# Altium project SixAx.PrjPcb
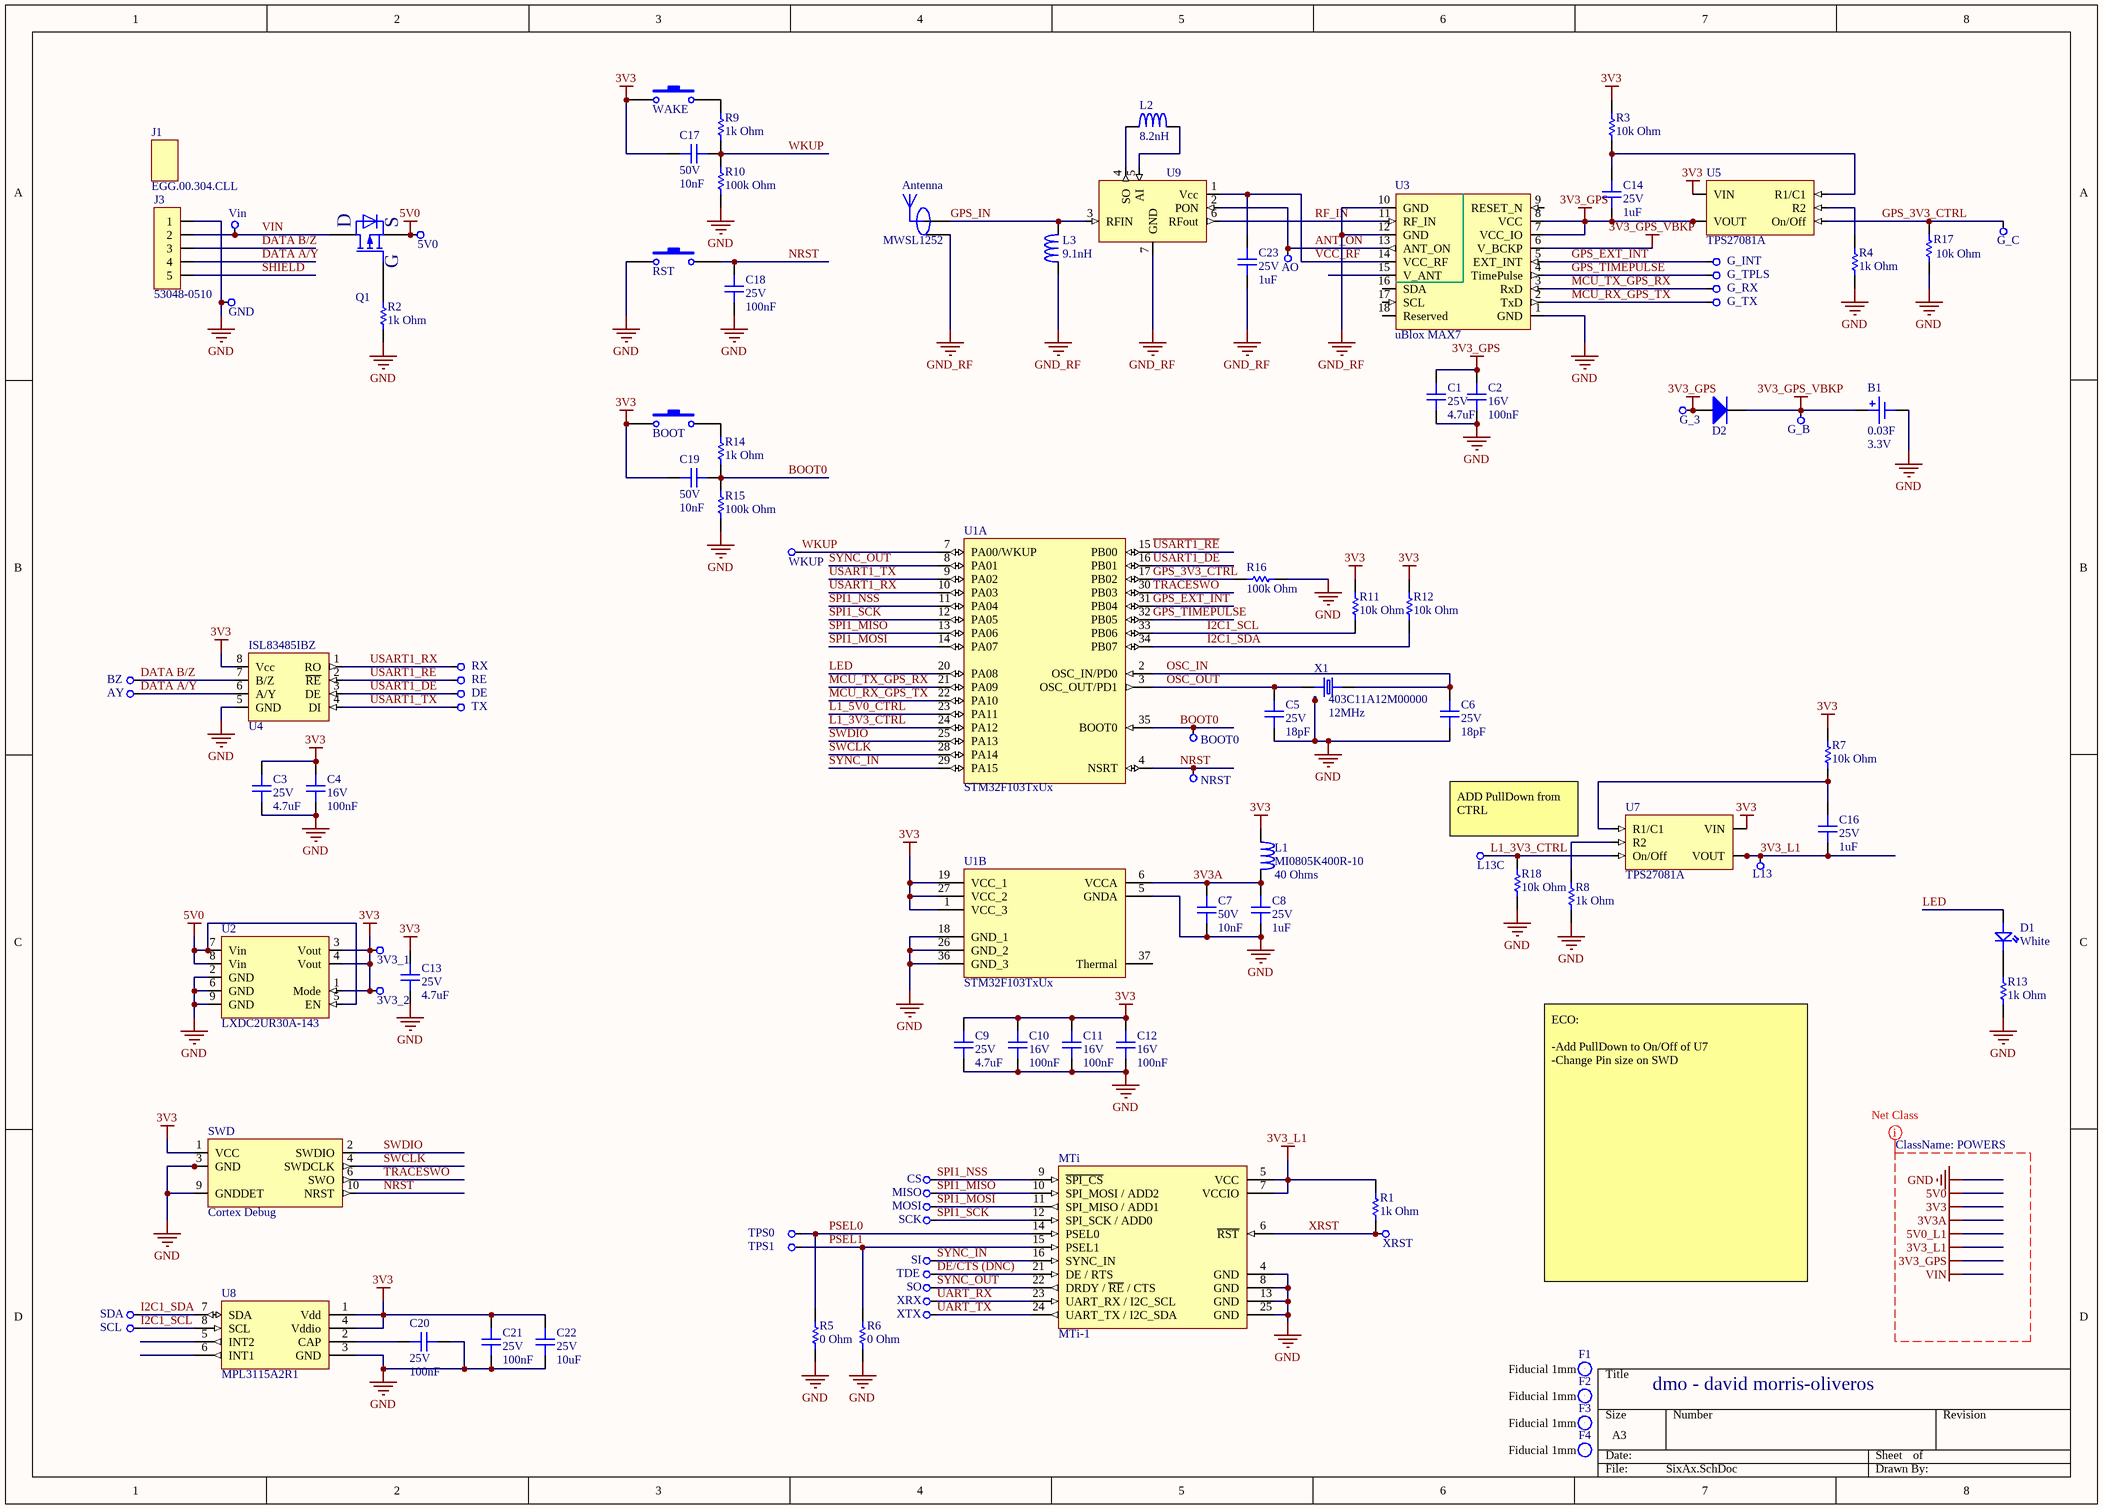
[diagram p0: SixAx.SchDoc]
1 sheet, 106 parts. Net scope: global (net labels, ports and power ports of the same name join across sheets).
Board file: SixAx.PcbDoc

## Sheet SixAx.SchDoc
size A3

### Parts
3V3_1  TEST  [TEST_1.0mm, SMD]  (value not drawn)
3V3_2  TEST  [TEST_1.0mm, SMD]  (value not drawn)
5V0  TEST  [TEST_1.0mm, SMD]  (value not drawn)
Antenna  MWSL1252  [MWSL1252 - Vertical - SMALLER]
AO  TEST  [TEST_0.5mm, SMD]  (value not drawn)
AY  TEST  [TEST_0.5mm, SMD]  (value not drawn)
B1  value 0.03F  Voltage: 3.3V  [PAS409HR-VE5R]  (hidden comment: PAS409HR-VE5R)
BOOT  TL1015AF160QG  [TL1015AF160QG]  (value not drawn)
BOOT0  TEST  [TEST_0.5mm, SMD]  (value not drawn)
BZ  TEST  [TEST_0.5mm, SMD]  (value not drawn)
C1  value 4.7uF  Voltage Rating: 25V  [CAP 0805]  (hidden comment: CL21A475KAQNNNE)
C2  value 100nF  Voltage Rating: 16V  [CAP 0402]  (hidden comment: CL05B104KO5NNNC)
C3  value 4.7uF  Voltage Rating: 25V  [CAP 0805]  (hidden comment: CL21A475KAQNNNE)
C4  value 100nF  Voltage Rating: 16V  [CAP 0402]  (hidden comment: CL05B104KO5NNNC)
C5  value 18pF  Voltage Rating: 25V  [CAP 0402]  (hidden comment: GRM1555C1E180JA01D)
C6  value 18pF  Voltage Rating: 25V  [CAP 0402]  (hidden comment: GRM1555C1E180JA01D)
C7  value 10nF  Voltage Rating: 50V  [CAP 0402]  (hidden comment: CL05B103KB5NNNC)
C8  value 1uF  Voltage Rating: 25V  [CAP 0603]  (hidden comment: TMK107B7105KA-T)
C9  value 4.7uF  Voltage Rating: 25V  [CAP 0805]  (hidden comment: CL21A475KAQNNNE)
C10  value 100nF  Voltage Rating: 16V  [CAP 0402]  (hidden comment: CL05B104KO5NNNC)
C11  value 100nF  Voltage Rating: 16V  [CAP 0402]  (hidden comment: CL05B104KO5NNNC)
C12  value 100nF  Voltage Rating: 16V  [CAP 0402]  (hidden comment: CL05B104KO5NNNC)
C13  value 4.7uF  Voltage Rating: 25V  [CAP 0805]  (hidden comment: CL21A475KAQNNNE)
C14  value 1uF  Voltage Rating: 25V  [CAP 0603]  (hidden comment: CL10A105KA8NNNC)
C16  value 1uF  Voltage Rating: 25V  [CAP 0603]  (hidden comment: CL10A105KA8NNNC)
C17  value 10nF  Voltage Rating: 50V  [CAP 0402]  (hidden comment: CL05B103KB5NNNC)
C18  value 100nF  Voltage Rating: 25V  [CAP 0402]  (hidden comment: CL05A104KA5NNNC)
C19  value 10nF  Voltage Rating: 50V  [CAP 0402]  (hidden comment: CL05B103KB5NNNC)
C20  value 100nF  Voltage Rating: 25V  [CAP 0402]  (hidden comment: CL05A104KA5NNNC)
C21  value 100nF  Voltage Rating: 25V  [CAP 0402]  (hidden comment: CL05A104KA5NNNC)
C22  value 10uF  Voltage Rating: 25V  [CAP 0805]  (hidden comment: CL21A106KAYNNNE)
C23  value 1uF  Voltage Rating: 25V  [CAP 0603]  (hidden comment: CL10A105KA8NNNC)
CS  TEST  [TEST_0.5mm, SMD]  (value not drawn)
D1  White  [LED 0603]
D2  CDSQR400B  [SOD-923F]  (value not drawn)
DE  TEST  [TEST_0.5mm, SMD]  (value not drawn)
F1  (no value)  [Fiducial_1mm]
F2  (no value)  [Fiducial_1mm]
F3  (no value)  [Fiducial_1mm]
F4  (no value)  [Fiducial_1mm]
G_3  TEST  [TEST_0.5mm, SMD]  (value not drawn)
G_B  TEST  [TEST_0.5mm, SMD]  (value not drawn)
G_C  TEST  [TEST_0.5mm, SMD]  (value not drawn)
G_INT  TEST  [TEST_0.5mm, SMD]  (value not drawn)
G_RX  TEST  [TEST_0.5mm, SMD]  (value not drawn)
G_TPLS  TEST  [TEST_0.5mm, SMD]  (value not drawn)
G_TX  TEST  [TEST_0.5mm, SMD]  (value not drawn)
GND  TEST  [TEST_1.0mm, SMD]  (value not drawn)
J1  EGG.00.304.CLL  [EGG.00.304.CLL]
J3  53048-0510  [PicoBlade, 53048-0510]
L1  MI0805K400R-10  Impedence: 40 Ohms  [IND 0805]
L2  value 8.2nH  [IND 0402]  (hidden comment: LQW15AN8N2J00D)
L3  value 9.1nH  [IND 0402]  (hidden comment: LQW15AN9N1J00D)
L13  TEST  [TEST_0.5mm, SMD]  (value not drawn)
L13C  TEST  [TEST_0.5mm, SMD]  (value not drawn)
MISO  TEST  [TEST_0.5mm, SMD]  (value not drawn)
MOSI  TEST  [TEST_0.5mm, SMD]  (value not drawn)
MTi  MTi-1  [PLCC28 - XSens MTi-1 Special]
NRST  TEST  [TEST_0.5mm, SMD]  (value not drawn)
Q1  PMV48XP,215  [SOT23-3]  (value not drawn)
R1  value 1k Ohm  [RES 0402]  (hidden comment: P311-1.00KLRTR-ND)
R2  value 1k Ohm  [RES 0402]  (hidden comment: P311-1.00KLRTR-ND)
R3  value 10k Ohm  [RES 0402]  (hidden comment: P311-10.0KLRTR-ND)
R4  value 1k Ohm  [RES 0402]  (hidden comment: P311-1.00KLRTR-ND)
R5  value 0 Ohm  [RES 0402]  (hidden comment: P311-0.0JRTR-ND)
R6  value 0 Ohm  [RES 0402]  (hidden comment: P311-0.0JRTR-ND)
R7  value 10k Ohm  [RES 0402]  (hidden comment: P311-10.0KLRTR-ND)
R8  value 1k Ohm  [RES 0402]  (hidden comment: P311-1.00KLRTR-ND)
R9  value 1k Ohm  [RES 0402]  (hidden comment: P311-1.00KLRTR-ND)
R10  value 100k Ohm  [RES 0402]  (hidden comment: P311-100KLRTR-ND)
R11  value 10k Ohm  [RES 0402]  (hidden comment: P311-10.0KLRTR-ND)
R12  value 10k Ohm  [RES 0402]  (hidden comment: P311-10.0KLRTR-ND)
R13  value 1k Ohm  [RES 0402]  (hidden comment: P311-1.00KLRTR-ND)
R14  value 1k Ohm  [RES 0402]  (hidden comment: P311-1.00KLRTR-ND)
R15  value 100k Ohm  [RES 0402]  (hidden comment: P311-100KLRTR-ND)
R16  value 100k Ohm  [RES 0402]  (hidden comment: P311-100KLRTR-ND)
R17  value 10k Ohm  [RES 0402]  (hidden comment: P311-10.0KLRTR-ND)
R18  value 10k Ohm  [RES 0402]  (hidden comment: P311-10.0KLRTR-ND)
RE  TEST  [TEST_0.5mm, SMD]  (value not drawn)
RST  TL1015AF160QG  [TL1015AF160QG]  (value not drawn)
RX  TEST  [TEST_0.5mm, SMD]  (value not drawn)
SCK  TEST  [TEST_0.5mm, SMD]  (value not drawn)
SCL  TEST  [TEST_0.5mm, SMD]  (value not drawn)
SDA  TEST  [TEST_0.5mm, SMD]  (value not drawn)
SI  TEST  [TEST_0.5mm, SMD]  (value not drawn)
SO  TEST  [TEST_0.5mm, SMD]  (value not drawn)
SWD  CORTEX_DEBUG  [H_05x02 - 1.27mm]  (value not drawn)
TDE  TEST  [TEST_0.5mm, SMD]  (value not drawn)
TPS0  TEST  [TEST_0.5mm, SMD]  (value not drawn)
TPS1  TEST  [TEST_0.5mm, SMD]  (value not drawn)
TX  TEST  [TEST_0.5mm, SMD]  (value not drawn)
U1  STM32F103TxUx  [QFN36 - 0.5mm - NO THERMAL VIAS]  (parts A,B of 2)
U2  LXDC2UR30A-143  [BGA - 9 - LXDC2UR]
U3  uBlox MAX7  [uBlox MAX7]
U4  ISL83485IBZ  [SOIC8]
U5  Manufacturer Part Number - Simple: TPS27081A  [SOT23-6]  (hidden comment: TPS27081ADDCR)
U7  Manufacturer Part Number - Simple: TPS27081A  [SOT23-6]  (hidden comment: TPS27081ADDCR)
U8  MPL3115A2R1  [MPL3115A2R1]
U9  BGM1043N7  [TSNP-7-10]  (value not drawn)
Vin  TEST  [TEST_1.0mm, SMD]  (value not drawn)
WAKE  EVQ-P44B3M  [EVQ-P44B3M - No Corner Holes]  (value not drawn)
WKUP  TEST  [TEST_0.5mm, SMD]  (value not drawn)
X1  403C11A12M00000  Frequency: 12MHz  [XTAL_3.2x2.5]
XRST  TEST  [TEST_0.5mm, SMD]  (value not drawn)
XRX  TEST  [TEST_0.5mm, SMD]  (value not drawn)
XTX  TEST  [TEST_0.5mm, SMD]  (value not drawn)

### Nets
3V3: 3V3_1.0 3V3_2.0 BOOT.1 C3.2 C4.2 C9.2 C10.2 C11.2 C12.2 C13.2 C17.1 C19.1 C21.2 C22.2 L1.1 R3.2 R7.2 R11.2 R12.2 SWD.1(VCC) U1.1(VCC_3) U1.19(VCC_1) U1.27(VCC_2) U2.1(Mode) U2.3(Vout) U2.4(Vout) U4.8(Vcc) U5.4(VIN) U7.4(VIN) U8.1(Vdd) U8.4(Vddio) WAKE.1
3V3_GPS: C1.2 C2.2 C14.1 D2.1(A) G_3.0 U3.7(VCC_IO) U3.8(VCC) U5.2(VOUT) U5.3(VOUT)
3V3_GPS_VBKP: B1.+ D2.2(K) G_B.0 U3.6(V_BCKP)
3V3_L1: C16.1 L13.0 MTi.5(VCC) MTi.7(VCCIO) R1.2 U7.2(VOUT) U7.3(VOUT)
3V3A: C7.2 C8.2 L1.2 U1.6(VCCA)
5V0: 5V0.0 Q1.2(S) U2.5(EN) U2.7(Vin) U2.8(Vin)
GND: B1.- C1.1 C2.1 C3.1 C4.1 C5.1 C6.1 C7.1 C8.1 C9.1 C10.1 C11.1 C12.1 C13.1 C18.1 C20.2 C21.1 C22.1 GND.0 J3.1 MTi.4(GND) MTi.8(GND) MTi.13(GND) MTi.25(GND) R2.1 R4.1 R5.1 R6.1 R8.1 R10.1 R13.2 R15.1 R16.2 R17.1 R18.1 RST.1 SWD.3(GND) SWD.5(GND) SWD.9(GNDDET) U1.5(GNDA) U1.18(GND_1) U1.26(GND_2) U1.36(GND_3) U2.2(GND) U2.6(GND) U2.9(GND) U3.1(GND) U4.5(GND) U8.3(GND) X1.2 X1.4
GND_RF: Antenna.GND C23.1 L3.1 U3.10(GND) U3.12(GND) U9.7(GND)
VIN: J3.2 Q1.3(D) Vin.0
~{USART1_RE}: RE.0 U1.15(PB00) U4.2(~{RE})
ANT_ON: AO.0 U3.13(ANT_ON) U9.2(PON)
BOOT0: BOOT0.0 C19.2 R14.1 R15.2 U1.35(BOOT0)
DATA A/Y: AY.0 J3.4 U4.6(A/Y)
DATA B/Z: BZ.0 J3.3 U4.7(B/Z)
DE/CTS (DNC): MTi.21(DE_/_RTS) TDE.0
GPS_3V3_CTRL: G_C.0 R16.1 R17.2 U1.17(PB02) U5.5(On/Off)
GPS_EXT_INT: G_INT.0 U1.31(PB04) U3.5(EXT_INT)
GPS_IN: Antenna.SIG L3.2 U9.3(RFIN)
GPS_TIMEPULSE: G_TPLS.0 U1.32(PB05) U3.4(TimePulse)
I2C1_SCL: R11.1 SCL.0 U1.33(PB06) U8.8(SCL)
I2C1_SDA: R12.1 SDA.0 U1.34(PB07) U8.7(SDA)
L1_3V3_CTRL: L13C.0 R18.2 U1.24(PA12) U7.5(On/Off)
L1_5V0_CTRL: U1.23(PA11)
LED: D1.A U1.20(PA08)
MCU_RX_GPS_TX: G_TX.0 U1.22(PA10) U3.2(TxD)
MCU_TX_GPS_RX: G_RX.0 U1.21(PA09) U3.3(RxD)
NRST: C18.2 NRST.0 RST.2 SWD.10(NRST) U1.4(NSRT)
OSC_IN: C6.2 U1.2(OSC_IN/PD0) X1.3
OSC_OUT: C5.2 U1.3(OSC_OUT/PD1) X1.1
PSEL0: MTi.14(PSEL0) R5.2 TPS0.0
PSEL1: MTi.15(PSEL1) R6.2 TPS1.0
RF_IN: U3.11(RF_IN) U9.6(RFout)
SHIELD: J3.5
SPI1_MISO: MISO.0 MTi.10(SPI_MOSI_/_ADD2) U1.13(PA06)
SPI1_MOSI: MOSI.0 MTi.11(SPI_MISO_/_ADD1) U1.14(PA07)
SPI1_NSS: CS.0 MTi.9(~{SPI_CS}) U1.11(PA04)
SPI1_SCK: MTi.12(SPI_SCK_/_ADD0) SCK.0 U1.12(PA05)
SWCLK: SWD.4(SWDCLK) U1.28(PA14)
SWDIO: SWD.2(SWDIO) U1.25(PA13)
SYNC_IN: MTi.16(SYNC_IN) SI.0 U1.29(PA15)
SYNC_OUT: MTi.22(DRDY_/_~{RE}_/_CTS) SO.0 U1.8(PA01)
TRACESWO: SWD.6(SWO) U1.30(PB03)
UART_RX: MTi.23(UART_RX_/_I2C_SCL) XRX.0
UART_TX: MTi.24(UART_TX_/_I2C_SDA) XTX.0
USART1_DE: DE.0 U1.16(PB01) U4.3(DE)
USART1_RX: RX.0 U1.10(PA03) U4.1(RO)
USART1_TX: TX.0 U1.9(PA02) U4.4(DI)
VCC_RF: C23.2 U3.14(VCC_RF) U9.1(Vcc)
WKUP: C17.2 R9.1 R10.2 U1.7(PA00/WKUP) WKUP.0
XRST: MTi.6(~{RST}) R1.1 XRST.0
NetBOOT_2: BOOT.2 R14.2
NetC14_2: C14.2 R3.1 U5.6(R1/C1)
NetC16_2: C16.2 R7.1 U7.6(R1/C1)
NetC20_1: C20.1 U8.2(CAP)
NetD1_K: D1.K R13.1
NetL2_1: L2.1 U9.4(SO)
NetL2_2: L2.2 U9.5(AI)
NetQ1_1: Q1.1(G) R2.2
NetR4_2: R4.2 U5.1(R2)
NetR8_2: R8.2 U7.1(R2)
NetR9_2: R9.2 WAKE.2

Not connected (* = marked no-connect by the designer): F1 1(Fiducial_1mm); F2 1(Fiducial_1mm); F3 1(Fiducial_1mm); F4 1(Fiducial_1mm); U1 37(Thermal); U3 9(RESET_N) 15(V_ANT) 16(SDA) 17(SCL) 18(Reserved); U8 5(INT2) 6(INT1)

### Layout directives
net class POWERS: 3V3, 3V3_GPS, 3V3_L1, 3V3A, 5V0, 5V0_L1, GND, VIN

### Notes on the sheet
- This weak pull-down is to ensure a 0 on BOOT1 when BOOT0 is high.
- ADD PullDown from CTRL
- ECO:
  -Add PullDown to On/Off of U7
  -Change Pin size on SWD
- dmo - david morris-oliveros

### Library data of the parts
Antenna = MWSL1252: GPS Antenna, Passive, SMD; Manufacturer: Maruwa; ComponentLink1Description: Datasheet; ComponentLink1URL: http://www.maruwa-g.com/e/products/electronic-parts/multifilar_antennas-gps_antennas.html; ManufacturerPartNumber: MWSL1252; Pins: 1; Series: GPS Antenna
B1 = PAS409HR-VE5R: Super Cap, 3.3V, 0.03F; Manufacturer: Taiyo Yuden; Manufacturer Part Number: PAS409HR-VE5R; ComponentLink1Description: Datasheet; ComponentLink1URL: http://media.digikey.com/pdf/Data%20Sheets/Taiyo%20Yuden%20PDFs%20URL%20links/PAS%20Coin%20Type%20Capacitor.pdf; Tolerance: *
BOOT RST = TL1015AF160QG: Switch, Tactile, SMD; Manufacturer: E-Switch; Manufacturer Part Number: TL1015AF160QG; ComponentLink1Description: Datasheet; ComponentLink1URL: http://www.mouser.com/ds/2/140/TL1015-346206.pdf; Tolerance: *
C1 C3 C9 C13 = CL21A475KAQNNNE: MLCC, 4.7uF, 0805, 10%, 25V, X5R; Manufacturer: Samsung; Temp Range: -55-125°C; Manufacturer Part Number: CL21A475KAQNNNE; ComponentLink1Description: Datasheet; ComponentLink1URL: http://www.samsungsem.com/servlet/ProductSearchView?page=1&searchIdx=1&lang=kr&partnum=1&find_val=CL21A475KAQNNNE; Temp Coefficient: X5R; Tolerance: 10%
C2 C4 C10-C12 = CL05B104KO5NNNC: MLCC, 100nF, 0402, 10%, 16V, X7R; Manufacturer: Samsung; Temp Range: -55-125°C; Manufacturer Part Number: CL05B104KO5NNNC; ComponentLink1Description: Datasheet; ComponentLink1URL: http://www.samsungsem.com/servlet/ProductSearchView?page=1&searchIdx=1&lang=kr&partnum=1&find_val=CL05B104KO5NNNC; Temp Coefficient: X7R; Tolerance: 10%
C5 C6 = GRM1555C1E180JA01D: MLCC, 18pF, 0402, 5%, 25V, C0G; Manufacturer: muRata; Temp Range: -55-125°C; Manufacturer Part Number: GRM1555C1E180JA01D; ComponentLink1Description: Datasheet; ComponentLink1URL: http://www.murata.com/products/catalog/pdf/c02e.pdf; Temp Coefficient: C0G; Tolerance: 5%
C7 C17 C19 = CL05B103KB5NNNC: MLCC, 10nF, 0402, 10%, 50V, X7R; Manufacturer: Samsung; Temp Range: -55-125°C; Tolerance: 5%; Manufacturer Part Number: CL05B103KB5NNNC; ComponentLink1Description: Datasheet; ComponentLink1URL: http://www.samsungsem.com/servlet/ProductSearchView?page=1&searchIdx=1&lang=kr&partnum=1&find_val=CL05B103KB5NNNC; Temp Coefficient: X7R
C8 = TMK107B7105KA-T: MLCC, 1uF, 0603, 10%, 25V; Manufacturer: Taiyo Yuden; Temp Coefficient: X7R; Temp Range: -55-125°C; Manufacturer Part Number: TMK107B7105KA-T; ComponentLink1Description: Datasheet; ComponentLink1URL: http://www.yuden.co.jp/or/product/category/capacitor/TMK107B7105KA-T.pdf; Tolerance: 10%
C14 C16 C23 = CL10A105KA8NNNC: MLCC, 1uF, 0603, 10%, 25V, X5R; Manufacturer: Samsung; Temp Range: -55-125°C; Manufacturer Part Number: CL10A105KA8NNNC; ComponentLink1Description: Datasheet; ComponentLink1URL: http://www.samsungsem.com/servlet/ProductSearchView?page=1&searchIdx=1&lang=kr&partnum=1&find_val=CL10A105KA8NNNC; Temp Coefficient: X5R; Tolerance: 10%
C18 C20 C21 = CL05A104KA5NNNC: MLCC, 100nF, 0402, 10%, 25V, X5R; Manufacturer: Samsung; Temp Range: -55-125°C; Manufacturer Part Number: CL05A104KA5NNNC; ComponentLink1Description: Datasheet; ComponentLink1URL: http://www.samsungsem.com/servlet/ProductSearchView?page=1&searchIdx=1&lang=kr&partnum=1&find_val=CL05A104KA5NNNC; Temp Coefficient: X5R; Tolerance: 10%
C22 = CL21A106KAYNNNE: MLCC, 10uF, 0805, 10%, 25V, X5R; Manufacturer: Samsung; Temp Range: -55-125°C; Manufacturer Part Number: CL21A106KAYNNNE; ComponentLink1Description: Datasheet; ComponentLink1URL: http://www.samsungsem.com/servlet/ProductSearchView?page=1&searchIdx=1&lang=kr&partnum=1&find_val=CL21A106KAYNNNE; Temp Coefficient: X5R; Tolerance: 10%
D1 = 1608SWD-04: LED, White, 0603; Manufacturer Part Number: 1608SWD-04; ComponentLink1Description: Datasheet; Colour: White
D2 = CDSQR400B: DIODE, Switching, Low Leakage, 90V, 100mA; Manufacturer: Comchip Technology; Vf: 1.0V @ 100mA; Reverse Leakage: 100nA; Manufacturer Part Number: CDSQR400B; ComponentLink1Description: Datasheet; ComponentLink1URL: http://www.mouser.com/ds/2/80/CDSQR400B-RevB370402-476902.pdf
F1-F4 = Fiducial 1mm: ComponentLink1Description: Datasheet
J1 = EGG.00.304.CLL: LEMO 00, 4-pin; Manufacturer Part Number: EGG.00.304.CLL; ComponentLink1Description: Datasheet; ComponentLink1URL: http://; Tolerance: *
J3 = 53048-0510: PicoBlade, Header, R/A, PTH, 5 Pos, 1.25mm Pitch; Manufacturer: Molex; Rows: 1; ComponentLink1Description: Datasheet; ComponentLink1URL: http://www.molex.com/molex/products/datasheet.jsp?part=active/0530480510_PCB_HEADERS.xml; ManufacturerPartNumber: 53048-0510; Pins: 5; Pitch: 1.25mm; Series: PicoBlade
L1 = MI0805K400R-10: IND, EMI, 40Ohm, 100MHz, 1.5A, 0805; Manufacturer: Laird; DCR: 50 mOhm max; Type: Ferrite Chip Bead; Core: Ferrite; Manufacturer Part Number: MI0805K400R-10; ComponentLink1Description: Datasheet; ComponentLink1URL: http://www.mouser.com/ds/2/223/MI0805K400R-10-587425.pdf
L2 = LQW15AN8N2J00D: IND, 8.2nH, 5%, 100MHz; Manufacturer: Murata Electronics; Manufacturer Part Number: LQW15AN8N2J00D; ComponentLink1Description: Datasheet; ComponentLink1URL: http://www.mouser.com/ds/2/281/o05e-522697.pdf
L3 = LQW15AN9N1J00D: IND, 9.1nH, 5%, 100MHz; Manufacturer: Murata Electronics; Manufacturer Part Number: LQW15AN9N1J00D; ComponentLink1Description: Datasheet; ComponentLink1URL: http://www.mouser.com/ds/2/281/o05e-522697.pdf
MTi = MTi-1: XSens MTi-1 Series; Manufacturer: XSens; Manufacturer Part Number: MTi-1; ComponentLink1Description: Datasheet; ComponentLink1URL: https://www.xsens.com/products/mti-1-series/?page_id=functions/mti-1/; Tolerance: *
Q1 = PMV48XP,215: MOSFET P-CH -20 V -3.5 A, SOT23-3; Manufacturer: NXP; Id: -3.5A; Vds: -20V; Rds: 55m Ohms; Manufacturer Part Number: PMV48XP,215; ComponentLink1Description: Datasheet; ComponentLink1URL: http://www.mouser.com/ds/2/302/PMV48XP-352572.pdf; Tolerance: *
R1 R2 R4 R8 R9 R13 R14 = P311-1.00KLRTR-ND: RES, 0402, 1k, 1%; Manufacturer: Yageo; Power: 63mW; Tolerance: 1%; Manufacturer Part Number: P311-1.00KLRTR-ND; ComponentLink1Description: Datasheet; ComponentLink1URL: http://www.yageo.com/NewPortal/_en/search/productDocs.jsp?YageoPartNumber=P311-1.00KLRTR-ND
R3 R7 R11 R12 R17 R18 = P311-10.0KLRTR-ND: RES, 0402, 10k, 1%; Manufacturer: Yageo; Power: 63mW; Tolerance: 1%; Manufacturer Part Number: P311-10.0KLRTR-ND; ComponentLink1Description: Datasheet; ComponentLink1URL: http://www.yageo.com/NewPortal/_en/search/productDocs.jsp?YageoPartNumber=P311-10.0KLRTR-ND
R5 R6 = P311-0.0JRTR-ND: RES, 0402, 0, 5%; Manufacturer: Yageo; Power: 63mW; Tolerance: 5%; Manufacturer Part Number: P311-0.0JRTR-ND; ComponentLink1Description: Datasheet; ComponentLink1URL: http://www.yageo.com/NewPortal/_en/search/productDocs.jsp?YageoPartNumber=RC0402JR-070RL
R10 R15 R16 = P311-100KLRTR-ND: RES, 0402, 100k, 1%; Manufacturer: Yageo; Power: 63mW; Tolerance: 1%; Manufacturer Part Number: P311-100KLRTR-ND; ComponentLink1Description: Datasheet; ComponentLink1URL: http://www.yageo.com/NewPortal/_en/search/productDocs.jsp?YageoPartNumber=P311-100KLRTR-ND
SWD = CORTEX_DEBUG: Cortex Debug; ComponentLink1Description: Datasheet; ComponentLink1URL: http://; Tolerance: *; Manufacturer Part Number: Cortex Debug
U1 = STM32F103TxUx: MCU, ARM-based 32-bit MCU with 64  or 128 KB Flash, USB, CAN, 7 timers, 2 ADCs, 9 com. interfaces; Part Number Eg: STM32F103TBU; Cortex: M3; ComponentLink1URL: http://www.st.com/st-web-ui/static/active/en/resource/technical/document/datasheet/CD00161566.pdf; ComponentLink1Description: Datasheet; ComponentLink2Description: http://www.st.com/web/catalog/mmc/FM141/SC1169/SS1031/LN1565/PF189782; Pins: 36
U2 = LXDC2UR30A-143: DC-DC 3.0Vout 600mA 2.5x2.3mm uDCDC; Manufacturer Part Number: LXDC2UR30A-143; ComponentLink1Description: Datasheet; ComponentLink1URL: http://www.mouser.com/ds/2/281/2UR_E-211770.pdf; Tolerance: *
U3 = uBlox MAX7: GPS, u-blox 7 GPS/GNSS module; Manufacturer Part Number: uBlox MAX7; ComponentLink1Description: Datasheet; ComponentLink1URL: http://www.u-blox.com/en/gps-modules/pvt-modules/max-7.html; Tolerance: *
U4 = ISL83485IBZ: RS-422/RS-485, 3.3V, HalfDuplex, TRN 1TX/1RX, W/SHTDN; Manufacturer: Intersil; Manufacturer Part Number: ISL83485IBZ; ComponentLink1Description: Datasheet; ComponentLink1URL: http://www.mouser.com/ds/2/465/isl83483-85-88-90-91-554566.pdf; Tolerance: *
U5 U7 = TPS27081ADDCR: High Side Load Switch PFET 1.2V-8V 3A; Manufacturer: TI; ComponentLink1Description: Datasheet; ComponentLink1URL: http://www.ti.com/product/tps27081a; Manufacturer Part Number: TPS27081ADDCR
U8 = MPL3115A2R1: Barometric Pressure Sensor, SMD; Manufacturer: Freescale; Manufacturer Part Number: MPL3115A2R1; ComponentLink1Description: Datasheet; ComponentLink1URL: http://www.mouser.com/ds/2/161/MPL3115A2-256325.pdf; Tolerance: *
U9 = BGM1043N7: RF, LNA, GPS; Manufacturer: Infineon; Manufacturer Part Number: BGM1043N7; ComponentLink1Description: Datasheet; ComponentLink1URL: http://www.mouser.com/ds/2/196/Infineon-BGM1043N7-DS-v03_00-en-537606.pdf; Tolerance: *
WAKE = EVQ-P44B3M: Switch, Tactile, Right Angle, Mid-Plane Mount,, SMD; Manufacturer: E-Switch; Manufacturer Part Number: EVQ-P44B3M; ComponentLink1Description: Datasheet; ComponentLink1URL: http://www.mouser.com/ds/2/315/ATV0000CE6-64395.pdf; Tolerance: *
X1 = 403C11A12M00000: Crystal 12MHz 10pF 10ppm 3.2x2.5mm; Manufacturer: CTS Electronic Components; Capacitor Calculation: C = 2x (CL - CS) ; CL = Load (10pF) ; CS = Stray. eg: 2-5pF; Manufacturer Part Number: 403C11A12M00000; ComponentLink1Description: Datasheet; ComponentLink1URL: http://www.mouser.com/ds/2/96/008-0288-0_F-16202.pdf; Tolerance: *; Stability: 10ppm; Loading: 10pF
3V3_1 3V3_2 5V0 AO AY BOOT0 BZ CS DE G_3 G_B G_C G_INT G_RX G_TPLS G_TX GND L13 L13C MISO MOSI NRST RE RX SCK SCL SDA SI SO TDE TPS0 TPS1 TX Vin WKUP XRST XRX XTX = TEST: ComponentLink1Description: Datasheet